# Altium schematic sheet ShiftMux.SchDoc
size A4; SheetNumber: 1; SheetTotal: 1
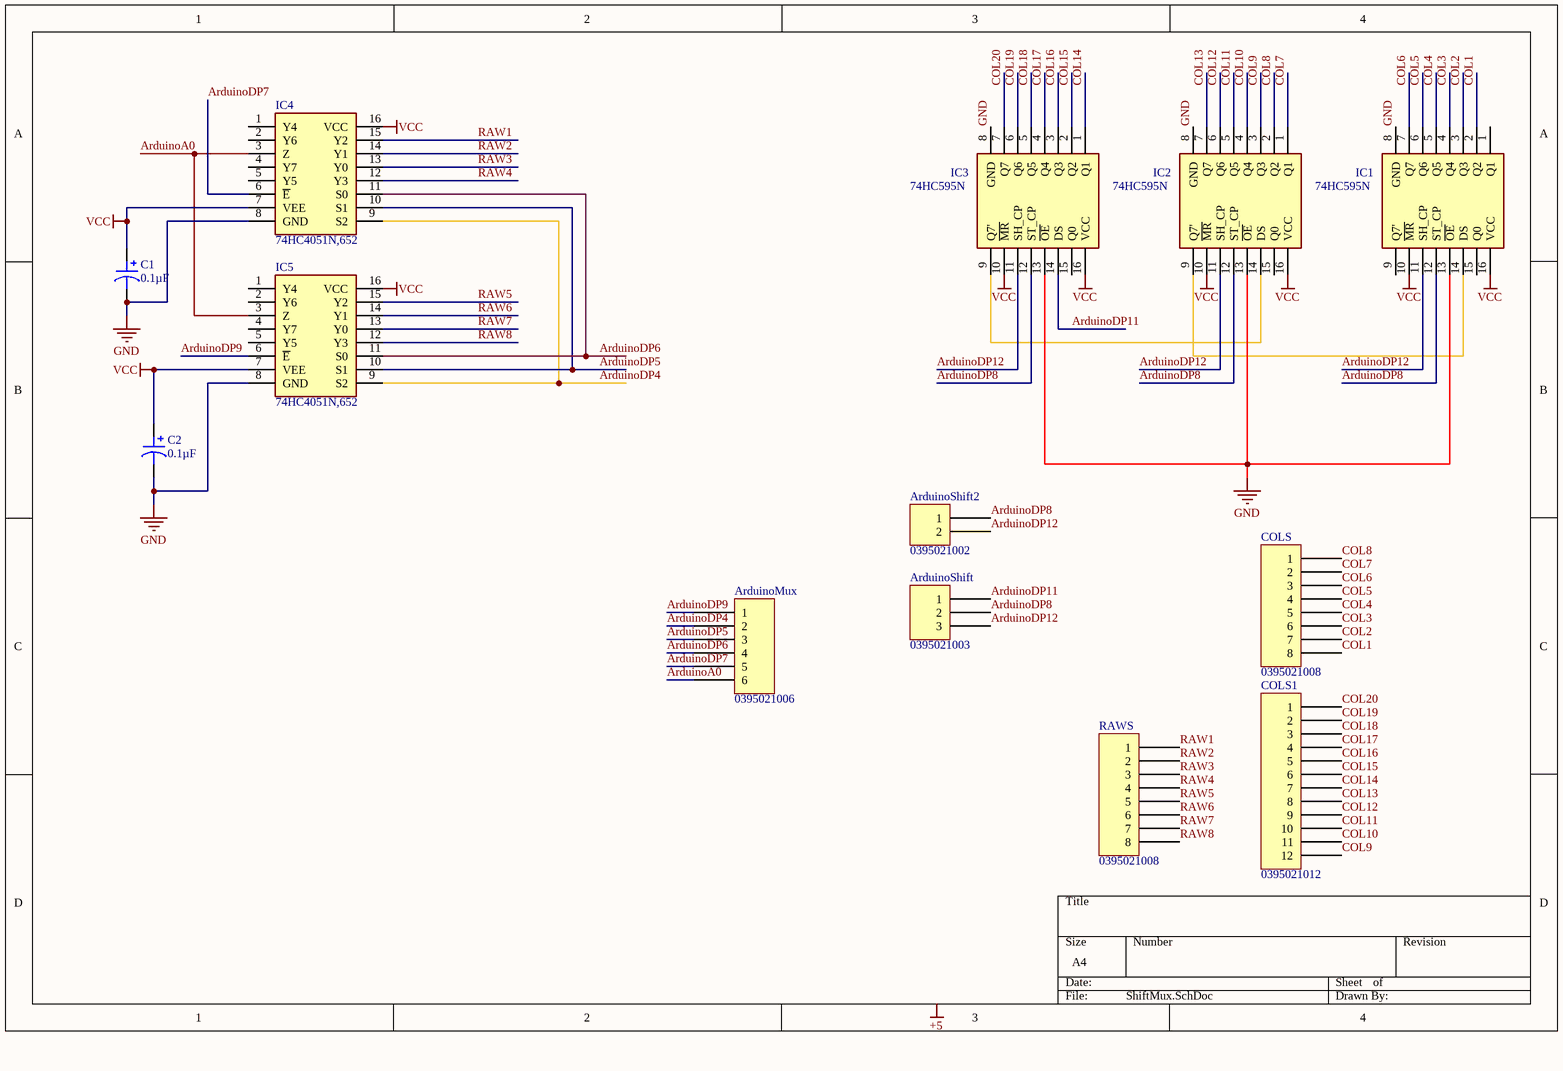
[diagram p0: ShiftMux.SchDoc]

## Parts
ArduinoMux  0395021006  [MOLEX 395021006]
ArduinoShift  0395021003  [MOLEX 395021003]
ArduinoShift2  0395021002  [MOLEX 395021002]
C1  0.1µF  [CAP ALSMD POLY 4.3MM H5.5MM]
C2  0.1µF  [CAP ALSMD POLY 4.3MM H5.5MM]
COLS  0395021008  [MOLEX 395021008]
COLS1  0395021012  [MOLEX 395021012]
IC1  74HC595N  [DIP762W53P254L1902H420Q16N]
IC2  74HC595N  [DIP762W53P254L1902H420Q16N]
IC3  74HC595N  [DIP762W53P254L1902H420Q16N]
IC4  74HC4051N,652  [DIP802W53P254L1902H420Q16N]
IC5  74HC4051N,652  [DIP802W53P254L1902H420Q16N]
RAWS  0395021008  [MOLEX 395021008]

## Nets
GND: C1.2 C2.2 IC1.8(GND) IC1.13(~{OE}) IC2.8(GND) IC2.13(~{OE}) IC3.8(GND) IC3.13(~{OE}) IC4.8(GND) IC5.8(GND)
VCC: C1.1 C2.1 IC1.10(~{MR}) IC1.16(VCC) IC2.10(~{MR}) IC2.16(VCC) IC3.10(~{MR}) IC3.16(VCC) IC4.7(VEE) IC4.16(VCC) IC5.7(VEE) IC5.16(VCC)
ArduinoA0: ArduinoMux.6 IC4.3(Z) IC5.3(Z)
ArduinoDP4: ArduinoMux.2 IC4.9(S2) IC5.9(S2)
ArduinoDP5: ArduinoMux.3 IC4.10(S1) IC5.10(S1)
ArduinoDP6: ArduinoMux.4 IC4.11(S0) IC5.11(S0)
ArduinoDP7: ArduinoMux.5 IC4.6(~{E})
ArduinoDP8: ArduinoShift.2 ArduinoShift2.1 IC1.12(ST_CP) IC2.12(ST_CP) IC3.12(ST_CP)
ArduinoDP9: ArduinoMux.1 IC5.6(~{E})
ArduinoDP11: ArduinoShift.1 IC3.14(DS)
ArduinoDP12: ArduinoShift.3 ArduinoShift2.2 IC1.11(SH_CP) IC2.11(SH_CP) IC3.11(SH_CP)
COL1: COLS.8 IC1.2(Q2)
COL2: COLS.7 IC1.3(Q3)
COL3: COLS.6 IC1.4(Q4)
COL4: COLS.5 IC1.5(Q5)
COL5: COLS.4 IC1.6(Q6)
COL6: COLS.3 IC1.7(Q7)
COL7: COLS.2 IC2.1(Q1)
COL8: COLS.1 IC2.2(Q2)
COL9: COLS1.12 IC2.3(Q3)
COL10: COLS1.11 IC2.4(Q4)
COL11: COLS1.10 IC2.5(Q5)
COL12: COLS1.9 IC2.6(Q6)
COL13: COLS1.8 IC2.7(Q7)
COL14: COLS1.7 IC3.1(Q1)
COL15: COLS1.6 IC3.2(Q2)
COL16: COLS1.5 IC3.3(Q3)
COL17: COLS1.4 IC3.4(Q4)
COL18: COLS1.3 IC3.5(Q5)
COL19: COLS1.2 IC3.6(Q6)
COL20: COLS1.1 IC3.7(Q7)
RAW1: IC4.15(Y2) RAWS.1
RAW2: IC4.14(Y1) RAWS.2
RAW3: IC4.13(Y0) RAWS.3
RAW4: IC4.12(Y3) RAWS.4
RAW5: IC5.15(Y2) RAWS.5
RAW6: IC5.14(Y1) RAWS.6
RAW7: IC5.13(Y0) RAWS.7
RAW8: IC5.12(Y3) RAWS.8
NetIC1_14: IC1.14(DS) IC2.9(Q7')
NetIC2_14: IC2.14(DS) IC3.9(Q7')

Not connected (* = marked no-connect by the designer): IC1 1(Q1) 9(Q7') 15(Q0); IC2 15(Q0); IC3 15(Q0); IC4 1(Y4) 2(Y6) 4(Y7) 5(Y5); IC5 1(Y4) 2(Y6) 4(Y7) 5(Y5)

## Notes on the sheet
- Labels drawn without touching a wire or pin: +5

## Library data of the parts
ArduinoMux = 0395021006: TERM BLOCK HDR 6POS 90DEG 3.5MM; Manufacturer: Molex; Current - UL: 8A; Header Orientation: 90°, Right Angle; Number of Levels: 1; Number of Positions: 6; Pitch: 0.138" (3.50mm); Voltage - UL: 300V; Part Number: 0395021006; Color: Black; ComponentLink1Description: Datasheet; ComponentLink1URL: https://www.molex.com/pdm_docs/sd/395021002_sd.pdf; ComponentLink2Description: DigiKey Link; ComponentLink2URL: http://digikey.com/product-detail/en/molex/0395021006/WM7774-ND/1280625; Contact Mating Finish: Tin; LastUpdated: 25.06.2020 15:45:17; Lifecycle Status: Active; Minimum Order: 1; Mounting Type: Through Hole; Operating Temperature: -40°C ~ 105°C; Packaging: Bulk; Part Status: Active; Positions Per Level: 6; Price: 1.40; Series: Eurostyle ESE 39502; Supplier 1: DigiKey; Supplier Part Number 1: WM7774-ND; Termination Style: Solder; Type: Header, Male Pins, Shrouded (4 Side)
ArduinoShift = 0395021003: TERM BLOCK HDR 3POS 90DEG 3.5MM; Manufacturer: Molex; Current - UL: 8A; Header Orientation: 90°, Right Angle; Number of Levels: 1; Number of Positions: 3; Pitch: 0.138" (3.50mm); Voltage - UL: 300V; Part Number: 0395021003; Color: Black; ComponentLink1Description: Datasheet; ComponentLink1URL: https://www.molex.com/pdm_docs/sd/395021002_sd.pdf; ComponentLink2Description: DigiKey Link; ComponentLink2URL: http://digikey.com/product-detail/en/molex/0395021003/WM7771-ND/1280622; Contact Mating Finish: Tin; LastUpdated: 25.06.2020 15:44:18; Lifecycle Status: Active; Minimum Order: 1; Mounting Type: Through Hole; Operating Temperature: -40°C ~ 105°C; Packaging: Tray; Part Status: Active; Positions Per Level: 3; Price: 0.78; Series: Eurostyle ESE 39502; Supplier 1: DigiKey; Supplier Part Number 1: WM7771-ND; Termination Style: Solder; Type: Header, Male Pins, Shrouded (4 Side)
ArduinoShift2 = 0395021002: TERM BLOCK HDR 2POS 90DEG 3.5MM; Manufacturer: Molex; Current - UL: 8A; Header Orientation: 90°, Right Angle; Number of Levels: 1; Number of Positions: 2; Pitch: 0.138" (3.50mm); Voltage - UL: 300V; Part Number: 0395021002; Color: Black; ComponentLink1Description: Datasheet; ComponentLink1URL: https://www.molex.com/pdm_docs/sd/395021002_sd.pdf; ComponentLink2Description: DigiKey Link; ComponentLink2URL: http://digikey.com/product-detail/en/molex/0395021002/WM7770-ND/1280621; Contact Mating Finish: Tin; LastUpdated: 25.06.2020 15:44:05; Lifecycle Status: Active; Minimum Order: 1; Mounting Type: Through Hole; Operating Temperature: -40°C ~ 105°C; Packaging: Tray; Part Status: Active; Positions Per Level: 2; Price: 0.58; Series: Eurostyle ESE 39502; Supplier 1: DigiKey; Supplier Part Number 1: WM7770-ND; Termination Style: Solder; Type: Header, Male Pins, Shrouded (4 Side)
C1 C2 = EMVA630ADAR10MD55G: CAP ALUM 0.1UF 20% 63V SMD; Manufacturer: United Chemi-Con; Lifetime @ Temp.: 2000 Hrs @ 85°C; Polarization: Polar; Ripple Current @ Low Frequency: 1.3mA @ 120Hz; Surface Mount Land Size: 0.169" L x 0.169" W (4.30mm x 4.30mm); Part Number: EMVA630ADAR10MD55G; Applications: General Purpose; Capacitance: 0.1µF; ComponentLink1Description: Datasheet; ComponentLink1URL: //media.digikey.com/pdf/Data%20Sheets/United%20Chemi-Con%20PDFs/MVA_Series_Rev_Sep2009.pdf; ComponentLink2Description: DigiKey Link; ComponentLink2URL: http://digikey.com/product-detail/en/united-chemi-con/EMVA630ADAR10MD55G/565-2140-1-ND/757301; Device Package: Radial, Can - SMD; Height - Seated (Max): 0.205" (5.20mm); LastUpdated: 2.09.2020 01:23:44; Lifecycle Status: Active; Minimum Order: 1; Mounting Type: Surface Mount; Operating Temperature: -40°C ~ 85°C; Package / Case: Radial, Can - SMD; Packaging: TapeAndReel; PartId: 7095; Part Status: Active; Price: 0.07; Series: Alchip™- MVA; Size / Dimension: 0.157" Dia (4.00mm); Supplier 1: DigiKey; Supplier Part Number 1: 565-2140-1-ND; Tolerance: ±20%; Value: 0.1µF; Voltage - Rated: 63V
COLS RAWS = 0395021008: TERM BLOCK HDR 8POS 90DEG 3.5MM; Manufacturer: Molex; Current - UL: 8A; Header Orientation: 90°, Right Angle; Number of Levels: 1; Number of Positions: 8; Pitch: 0.138" (3.50mm); Voltage - UL: 300V; Part Number: 0395021008; Color: Black; ComponentLink1Description: Datasheet; ComponentLink1URL: https://www.molex.com/pdm_docs/sd/395021002_sd.pdf; ComponentLink2Description: DigiKey Link; ComponentLink2URL: http://digikey.com/product-detail/en/molex/0395021008/WM7776-ND/1280627; Contact Mating Finish: Tin; LastUpdated: 25.06.2020 15:46:31; Lifecycle Status: Active; Minimum Order: 1; Mounting Type: Through Hole; Operating Temperature: -40°C ~ 105°C; Packaging: Bulk; Part Status: Active; Positions Per Level: 8; Price: 1.97; Series: Eurostyle ESE 39502; Supplier 1: DigiKey; Supplier Part Number 1: WM7776-ND; Termination Style: Solder; Type: Header, Male Pins, Shrouded (4 Side)
COLS1 = 0395021012: TERM BLOCK HDR 12POS 90DEG 3.5MM; Manufacturer: Molex; Current - UL: 8A; Header Orientation: 90°, Right Angle; Number of Levels: 1; Number of Positions: 12; Pitch: 0.138" (3.50mm); Voltage - UL: 300V; Part Number: 0395021012; Color: Black; ComponentLink1Description: Datasheet; ComponentLink1URL: https://www.molex.com/pdm_docs/sd/395021002_sd.pdf; ComponentLink2Description: DigiKey Link; ComponentLink2URL: http://digikey.com/product-detail/en/molex/0395021012/WM7780-ND/1280631; Contact Mating Finish: Tin; LastUpdated: 25.06.2020 15:47:47; Lifecycle Status: Active; Minimum Order: 1; Mounting Type: Through Hole; Operating Temperature: -40°C ~ 105°C; Packaging: Bulk; Part Status: Active; Positions Per Level: 12; Price: 2.75; Series: Eurostyle ESE 39502; Supplier 1: DigiKey; Supplier Part Number 1: WM7780-ND; Termination Style: Solder; Type: Header, Male Pins, Shrouded (4 Side)
IC1-IC3 = 74HC595N: Integrated Circuit; Manufacturer_Name: NXP; Datasheet Link: https://datasheet.datasheetarchive.com/originals/distributors/SFDatasheet-4/sf-00080087.pdf; Height: 4.2mm; Manufacturer_Part_Number: 74HC595N
IC4 IC5 = 74HC4051N,652: Integrated Circuit; Manufacturer_Name: Nexperia; Datasheet Link: http://media.digikey.com/pdf/Data%20Sheets/NXP%20PDFs/74HC(T)4051_Rev_Feb2017.pdf; Height: 4.2mm; Manufacturer_Part_Number: 74HC4051N,652